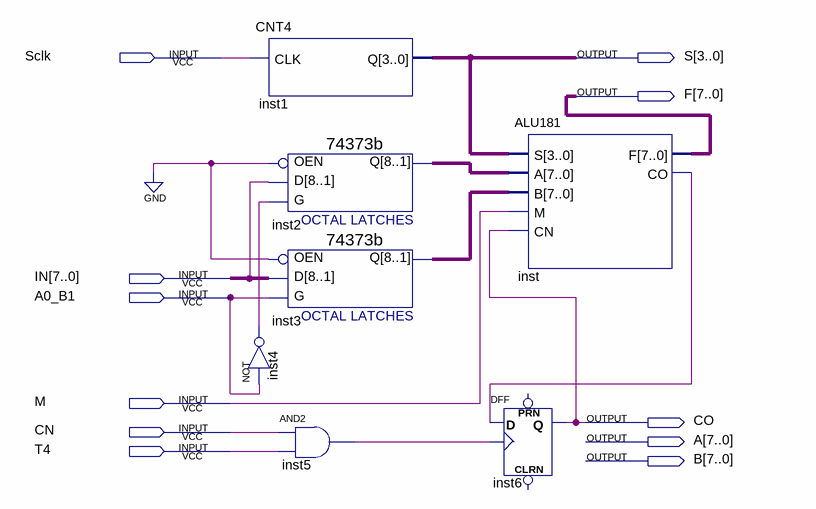
[diagram p0: schematic sheet]
// Quartus schematic ALU.bdf as structural Verilog: 7 symbols, 11 pins
module ALU (
  input  Sclk,
  input  [7:0] IN,
  input  A0_B1,
  input  M,
  input  CN,
  input  T4,
  output [3:0] S,
  output [7:0] F,
  output CO,
  output [7:0] A,
  output [7:0] B
);

  wire inst4_out, inst5_out, inst_co, undriven;
  wire [7:0] inst2_q, inst3_q;

  CNT4 inst1 (.CLK(Sclk), .Q(S));
  \74373b  inst2 (.D({8{undriven}}), .G(inst4_out), .OEN(1'b0), .Q(inst2_q));
  \74373b  inst3 (.D(IN), .G(A0_B1), .OEN(1'b0), .Q(inst3_q));
  not inst4 (inst4_out, A0_B1);
  and inst5 (inst5_out, CN, T4);
  DFF inst6 (.CLK(inst5_out), .D(inst_co), .Q(CO));  // open: CLRN, PRN
  ALU181 inst (.S(S), .A(inst2_q), .B(inst3_q), .M(M), .CN(CO), .F(F), .CO(inst_co));
endmodule
